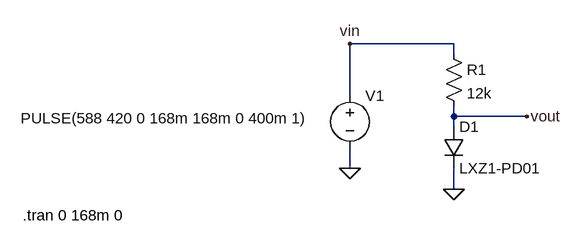
[diagram p0: schematic discharge.asc]
discharge.asc, the LTspice schematic file:
Version 4.1
SHEET 1 880 680
WIRE 96 32 -64 32
WIRE 96 48 96 32
WIRE -64 112 -64 32
WIRE 96 144 96 128
WIRE 208 144 96 144
WIRE 96 160 96 144
WIRE -64 224 -64 192
WIRE 96 256 96 224
FLAG -64 224 0
FLAG 208 144 vout
FLAG -64 32 vin
FLAG 96 256 0
SYMBOL voltage -64 96 R0
WINDOW 3 -507 51 Left 2
WINDOW 123 0 0 Left 0
WINDOW 39 0 0 Left 0
SYMATTR InstName V1
SYMATTR Value PULSE(588 420 0 168m 168m 0 400m 1)
SYMBOL res 80 32 R0
SYMATTR InstName R1
SYMATTR Value 12k
SYMBOL diode 80 160 R0
SYMATTR InstName D1
SYMATTR Value LXZ1-PD01
SYMATTR Description Diode
SYMATTR Type diode
TEXT -568 296 Left 2 !.tran 0 168m 0

The netlist it stands for:
* discharge.asc
V1 vin 0 PULSE(588 420 0 168m 168m 0 400m 1)
R1 vin vout 12k
D1 vout 0 LXZ1-PD01
.model D D
.lib standard.dio
.tran 0 168m 0
.backanno
.end